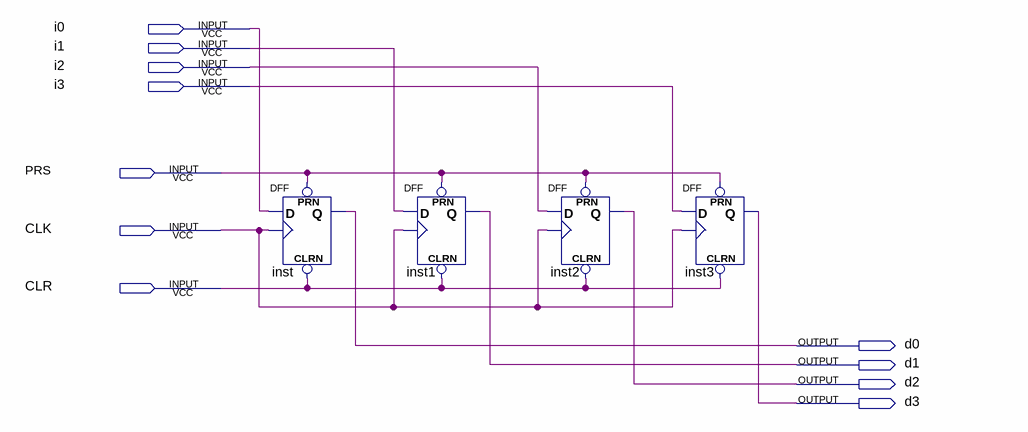
[diagram p0: schematic sheet]
// Quartus schematic t4bit_data.bdf as structural Verilog: 4 symbols, 11 pins
module t4bit_data (
  input  i0,
  input  i1,
  input  i2,
  input  i3,
  input  PRS,
  input  CLK,
  input  CLR,
  output d0,
  output d1,
  output d2,
  output d3
);

  DFF inst (.CLRN(CLR), .CLK(CLK), .D(i0), .PRN(PRS), .Q(d0));
  DFF inst1 (.CLRN(CLR), .CLK(CLK), .D(i1), .PRN(PRS), .Q(d1));
  DFF inst2 (.CLRN(CLR), .CLK(CLK), .D(i2), .PRN(PRS), .Q(d2));
  DFF inst3 (.CLRN(CLR), .CLK(CLK), .D(i3), .PRN(PRS), .Q(d3));
endmodule
